# Altium schematic sheet Halfbridge.SchDoc
size A4; Author: Luis Henrique DAvila Possatti; Organization: University of Campinas
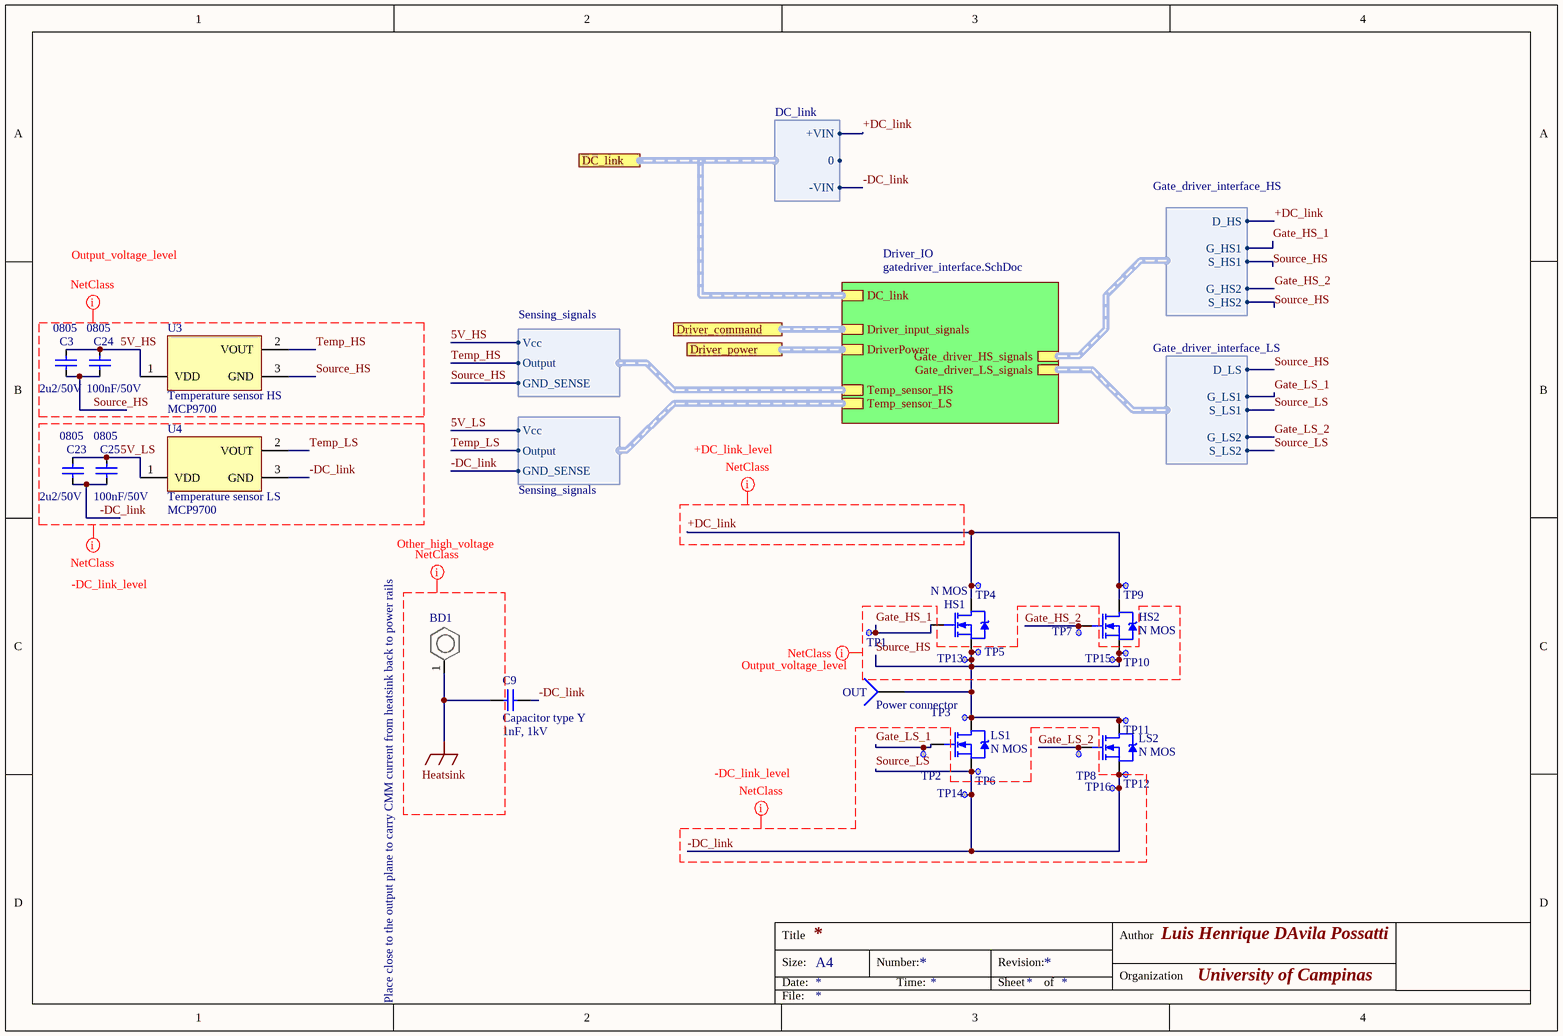
[diagram p0: Halfbridge.SchDoc]

## Parts
BD1  Place near output plane  [Bonding_screw]  (value not drawn)
C3  0805  value 2u2/50V  [Capacitor 0805]
C9  Capacitor type Y  value 1nF, 1kV  [CAPACITOR 1812]
C23  0805  value 2u2/50V  [Capacitor 0805]
C24  0805  value 100nF/50V  [Capacitor 0805]
C25  0805  value 100nF/50V  [Capacitor 0805]
HS1  N MOS  [TO247 custom 4]
HS2  N MOS  [TO247 custom 4]
LS1  N MOS  [TO247 custom 4]
LS2  N MOS  [TO247 custom 4]
OUT  Power connector  [7799 Power Connector]
TP1  Test point  [Test point]  (value not drawn)  (no BOM)
TP2  Test point  [Test point]  (value not drawn)  (no BOM)
TP3  Test point  [Test point]  (value not drawn)  (no BOM)
TP4  Test point  [Test point]  (value not drawn)  (no BOM)
TP5  Test point  [Test point SMD]  (value not drawn)  (no BOM)
TP6  Test point  [Test point]  (value not drawn)  (no BOM)
TP7  Test point  [Test point]  (value not drawn)  (no BOM)
TP8  Test point  [Test point]  (value not drawn)  (no BOM)
TP9  Test point  [Test point]  (value not drawn)  (no BOM)
TP10  Test point  [Test point SMD]  (value not drawn)  (no BOM)
TP11  Test point  [Test point]  (value not drawn)  (no BOM)
TP12  Test point  [Test point]  (value not drawn)  (no BOM)
TP13  Test point  [Test point SMD]  (value not drawn)  (no BOM)
TP14  Test point  [Test point]  (value not drawn)  (no BOM)
TP15  Test point  [Test point SMD]  (value not drawn)  (no BOM)
TP16  Test point  [Test point]  (value not drawn)  (no BOM)
U3  Temperature sensor HS  value MCP9700  [SOT 23]
U4  Temperature sensor LS  value MCP9700  [SOT 23]

## Sub-sheets
Driver_IO = gatedriver_interface.SchDoc: Gate_driver_HS_signals (harness Gate_driver_interface_HS), Gate_driver_LS_signals (harness Gate_driver_interface_LS), Driver_input_signals (harness Driver_input_connections), DriverPower (harness PowerSupplyOutputs), Temp_sensor_HS (harness Sensing_signals), Temp_sensor_LS (harness Sensing_signals), DC_link (harness DC_link)

## Ports
DC_link (harness DC_link), Driver_command (harness Driver_input_connections), Driver_power (harness PowerSupplyOutputs)

## Harnesses
Gate_driver_interface_HS: G_HS1, S_HS1, G_HS2, S_HS2, D_HS
Gate_driver_interface_LS: G_LS1, S_LS1, G_LS2, S_LS2, D_LS
DC_link: +VIN, -VIN, 0
Sensing_signals: GND_SENSE, Output, Vcc

## Nets
Heatsink: BD1.1 C9.1
5V_HS: C3.1 C24.1 U3.1(VDD) ; sheet Driver_IO/Temp_sensor_HS.Vcc
5V_LS: C23.1 C25.1 U4.1(VDD) ; sheet Driver_IO/Temp_sensor_LS.Vcc
+DC_link: HS1.2(D) HS2.2(D) TP4.1 TP9.1 ; sheet Driver_IO/Gate_driver_HS_signals.D_HS, port DC_link.+VIN
-DC_link: C9.2 C23.2 C25.2 LS1.3(S) LS2.3(S) TP6.1 TP12.1 TP14.1 TP16.1 U4.3(GND) ; sheet Driver_IO/Gate_driver_LS_signals.S_LS1, sheet Driver_IO/Gate_driver_LS_signals.S_LS2, port DC_link.-VIN, sheet Driver_IO/Temp_sensor_LS.GND_SENSE  [also labelled Source_LS]
Gate_HS_1: HS1.1(G) TP1.1 ; sheet Driver_IO/Gate_driver_HS_signals.G_HS1
Gate_HS_2: HS2.1(G) TP7.1 ; sheet Driver_IO/Gate_driver_HS_signals.G_HS2
Gate_LS_1: LS1.1(G) TP2.1 ; sheet Driver_IO/Gate_driver_LS_signals.G_LS1
Gate_LS_2: LS2.1(G) TP8.1 ; sheet Driver_IO/Gate_driver_LS_signals.G_LS2
Source_HS: C3.2 C24.2 HS1.3(S) HS2.3(S) LS1.2(D) LS2.2(D) OUT.1 TP3.1 TP5.1 TP10.1 TP11.1 TP13.1 TP15.1 U3.3(GND) ; sheet Driver_IO/Gate_driver_HS_signals.S_HS1, sheet Driver_IO/Gate_driver_HS_signals.S_HS2, sheet Driver_IO/Gate_driver_LS_signals.D_LS, sheet Driver_IO/Temp_sensor_HS.GND_SENSE
Temp_HS: U3.2(VOUT) ; sheet Driver_IO/Temp_sensor_HS.Output
Temp_LS: U4.2(VOUT) ; sheet Driver_IO/Temp_sensor_LS.Output

## Buses and harness runs
harness port DC_link = sheet Driver_IO/DC_link
harness port Driver_command = sheet Driver_IO/Driver_input_signals
harness port Driver_power = sheet Driver_IO/DriverPower

## Layout directives
net class -DC_link_level: 5V_LS, -DC_link, Gate_LS_1, Gate_LS_2, Source_LS, Temp_LS
net class Output_voltage_level: 5V_HS, Gate_HS_1, Gate_HS_2, Source_HS, Temp_HS
net class +DC_link_level: +DC_link
net class Other_high_voltage: Heatsink

## Notes on the sheet
- (near BD1) Place close to the output plane to carry CMM current from heatsink back to power rails
- Title
- Size:
- Date:
- A4
- Number:
- Time:
- Revision:
- Sheet
- of
- Author
- Organization
- File:

## Library data of the parts
BD1 = Bonding_screw: Used to connect the net to the heatsink below board; value: Pan Head; pn: M3 screw
C3 C23-C25 = Capacitor 0805: SMD ceramic capacitor 0805; pn: undefined
C9 = Y Capacitor: High Voltage Capacitor to filter EMC from heatsink; pn: C1210C104KBRAC7800, C1812C104KDRAC7800; ClassName: Direct_plane_connect
HS1 HS2 LS1 LS2 = MOSFET: Power Mosfet N channel, TO-247, multiple part numbers; PN: SCT2280KEC, STW28N65M2, IRFP4321PBFD; Value: 14A, 1200V; ClassName: Direct_plane_connect, Mosfets
OUT = Power connector: TERM SCREW M4 6 PIN PCB; PN: 36-7799-ND; Value: Connector 7799; ClassName: Direct_plane_connect
TP1 = Test point: Test point to probe with oscilloscope; Signal_name: G1_HS; ClassName: Direct_plane_connect, test_point
TP2 = Test point: Test point to probe with oscilloscope; Signal_name: G1_LS; ClassName: Direct_plane_connect, test_point
TP3 = Test point: Test point to probe with oscilloscope; Signal_name: D1_LS; ClassName: Direct_plane_connect, test_point
TP4 = Test point: Test point to probe with oscilloscope; Signal_name: D1_HS; ClassName: Direct_plane_connect, test_point
TP5 TP13 = Test point: Test point to probe with oscilloscope; Signal_name: S1_HS; ClassName: Direct_plane_connect, test_point
TP6 TP14 = Test point: Test point to probe with oscilloscope; Signal_name: S1_LS; ClassName: Direct_plane_connect, test_point
TP7 = Test point: Test point to probe with oscilloscope; Signal_name: G2_HS; ClassName: Direct_plane_connect, test_point
TP8 = Test point: Test point to probe with oscilloscope; Signal_name: G2_LS; ClassName: Direct_plane_connect, test_point
TP9 = Test point: Test point to probe with oscilloscope; Signal_name: D2_HS; ClassName: Direct_plane_connect, test_point
TP10 TP15 = Test point: Test point to probe with oscilloscope; Signal_name: S2_HS; ClassName: Direct_plane_connect, test_point
TP11 = Test point: Test point to probe with oscilloscope; Signal_name: D2_LS; ClassName: Direct_plane_connect, test_point
TP12 TP16 = Test point: Test point to probe with oscilloscope; Signal_name: S2_LS; ClassName: Direct_plane_connect, test_point
U3 U4 = MCP9700T-E/TT: Low-Power Linear Active Thermistor IC, 3-Pin SOT-23, Extended Temperature, Tape and Reel; ComponentLink1Description: Manufacturer URL; ComponentLink1URL: http://www.microchip.com/; ComponentLink2Description: Datasheet; ComponentLink2URL: http://ww1.microchip.com/downloads/en/DeviceDoc/21942e.pdf; ComponentLink3Description: Package Specification; ComponentLink3URL: http://www.microchip.com/stellent/groups/techpub_sg/documents/packagingspec/en012702.pdf; pn: MCP9700T-E/TT
  U4: ClassName: Direct_plane_connect